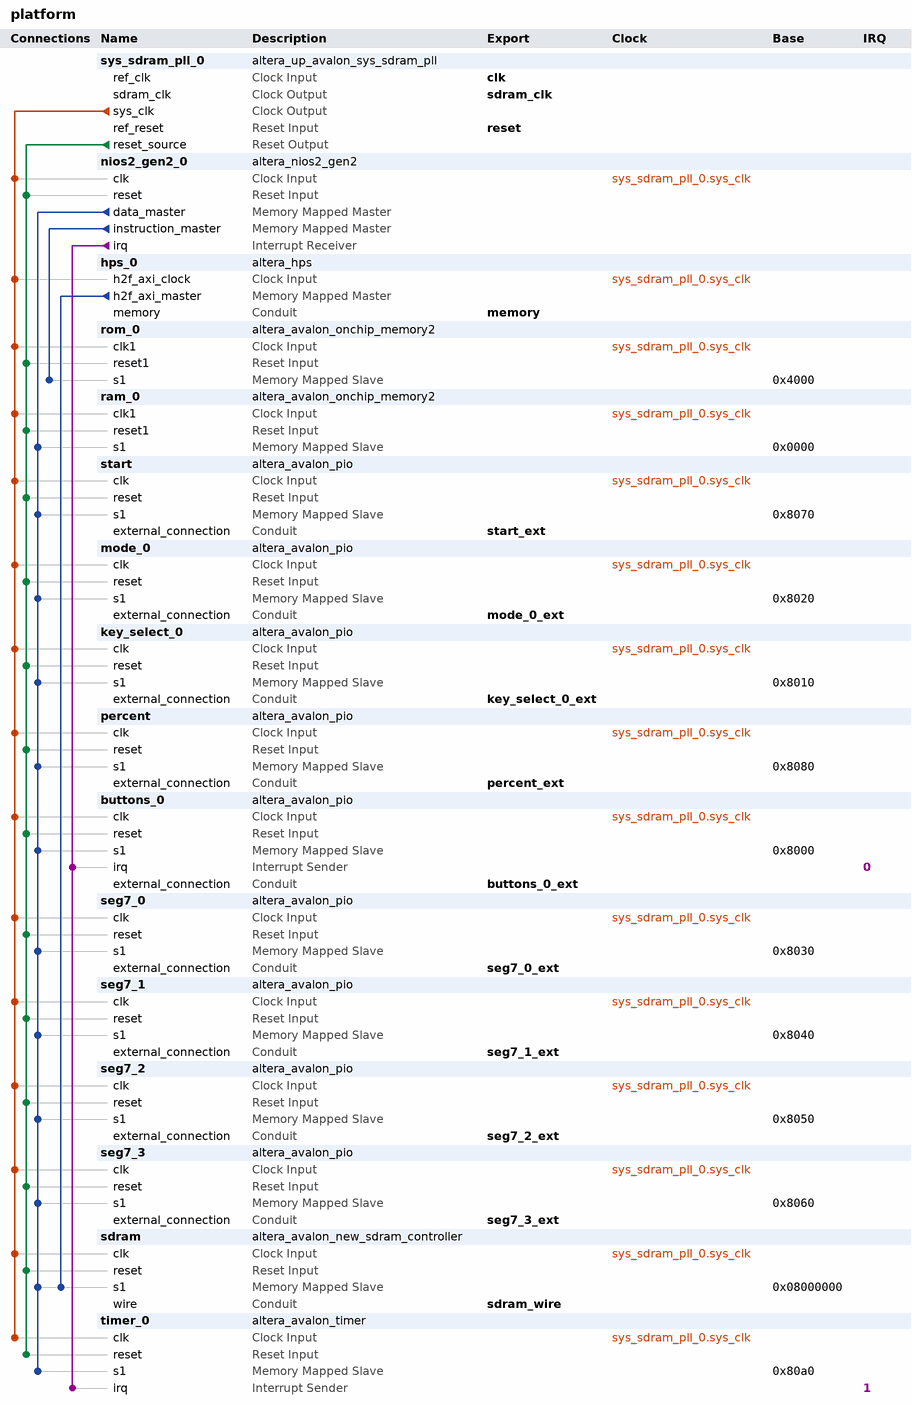
[diagram p0: system contents]
# Platform Designer (Qsys) system platform, Cyclone V 5CSEMA5F31C6
# Parameters at their usual value, and those the tool derives, are not listed.
package require -exact qsys 20.1
create_system platform
set_project_property DEVICE_FAMILY {Cyclone V}
set_project_property DEVICE 5CSEMA5F31C6

add_instance sys_sdram_pll_0 altera_up_avalon_sys_sdram_pll 18.0
set_instance_parameter_value sys_sdram_pll_0 CV_boards DE1-SoC
set_instance_parameter_value sys_sdram_pll_0 gui_outclk 50.0
set_instance_parameter_value sys_sdram_pll_0 gui_refclk 50.0

add_instance nios2_gen2_0 altera_nios2_gen2 20.1
set_instance_parameter_value nios2_gen2_0 dcache_size 2048
set_instance_parameter_value nios2_gen2_0 debug_enabled false
set_instance_parameter_value nios2_gen2_0 exceptionSlave rom_0.s1
set_instance_parameter_value nios2_gen2_0 icache_size 4096
set_instance_parameter_value nios2_gen2_0 impl Tiny
set_instance_parameter_value nios2_gen2_0 resetSlave rom_0.s1

add_instance hps_0 altera_hps 20.1
set_instance_parameter_value hps_0 EMAC1_Mode N/A
set_instance_parameter_value hps_0 EMAC1_PinMuxing Unused
set_instance_parameter_value hps_0 F2SCLK_COLDRST_Enable false
set_instance_parameter_value hps_0 F2SCLK_DBGRST_Enable false
set_instance_parameter_value hps_0 F2SCLK_WARMRST_Enable false
set_instance_parameter_value hps_0 F2SINTERRUPT_Enable false
set_instance_parameter_value hps_0 F2S_Width 0
set_instance_parameter_value hps_0 FPGA_PERIPHERAL_OUTPUT_CLOCK_FREQ_EMAC0_GTX_CLK 125
set_instance_parameter_value hps_0 FPGA_PERIPHERAL_OUTPUT_CLOCK_FREQ_EMAC0_MD_CLK 2.5
set_instance_parameter_value hps_0 FPGA_PERIPHERAL_OUTPUT_CLOCK_FREQ_EMAC1_GTX_CLK 125
set_instance_parameter_value hps_0 FPGA_PERIPHERAL_OUTPUT_CLOCK_FREQ_EMAC1_MD_CLK 2.5
set_instance_parameter_value hps_0 HPS_PROTOCOL DDR3
set_instance_parameter_value hps_0 I2C0_Mode N/A
set_instance_parameter_value hps_0 I2C0_PinMuxing Unused
set_instance_parameter_value hps_0 I2C1_Mode N/A
set_instance_parameter_value hps_0 I2C1_PinMuxing Unused
set_instance_parameter_value hps_0 LWH2F_Enable false
set_instance_parameter_value hps_0 MEM_BANKADDR_WIDTH 3
set_instance_parameter_value hps_0 MEM_CLK_FREQ 300.0
set_instance_parameter_value hps_0 MEM_CLK_FREQ_MAX 400.0
set_instance_parameter_value hps_0 MEM_COL_ADDR_WIDTH 8
set_instance_parameter_value hps_0 MEM_DQ_WIDTH 8
set_instance_parameter_value hps_0 MEM_DRV_STR RZQ/6
set_instance_parameter_value hps_0 MEM_ROW_ADDR_WIDTH 12
set_instance_parameter_value hps_0 MEM_RTT_NOM {ODT Disabled}
set_instance_parameter_value hps_0 MEM_RTT_WR {Dynamic ODT off}
set_instance_parameter_value hps_0 MEM_TCL 7
set_instance_parameter_value hps_0 MEM_TFAW_NS 37.5
set_instance_parameter_value hps_0 MEM_TINIT_US 499
set_instance_parameter_value hps_0 MEM_TMRD_CK 3
set_instance_parameter_value hps_0 MEM_TRAS_NS 40.0
set_instance_parameter_value hps_0 MEM_TRCD_NS 15.0
set_instance_parameter_value hps_0 MEM_TREFI_US 7.0
set_instance_parameter_value hps_0 MEM_TRFC_NS 75.0
set_instance_parameter_value hps_0 MEM_TRP_NS 15.0
set_instance_parameter_value hps_0 MEM_TWTR 2
set_instance_parameter_value hps_0 MEM_VENDOR JEDEC
set_instance_parameter_value hps_0 MEM_WTCL 6
set_instance_parameter_value hps_0 QSPI_Mode N/A
set_instance_parameter_value hps_0 QSPI_PinMuxing Unused
set_instance_parameter_value hps_0 REF_CLK_FREQ 125.0
set_instance_parameter_value hps_0 S2FCLK_USER2CLK 5
set_instance_parameter_value hps_0 S2F_Width 1
set_instance_parameter_value hps_0 SDIO_Mode N/A
set_instance_parameter_value hps_0 SDIO_PinMuxing Unused
set_instance_parameter_value hps_0 SPIM1_Mode N/A
set_instance_parameter_value hps_0 SPIM1_PinMuxing Unused
set_instance_parameter_value hps_0 STM_Enable false
set_instance_parameter_value hps_0 TIMING_BOARD_AC_SKEW 0.02
set_instance_parameter_value hps_0 TIMING_BOARD_AC_TO_CK_SKEW 0.0
set_instance_parameter_value hps_0 TIMING_BOARD_DQ_TO_DQS_SKEW 0.0
set_instance_parameter_value hps_0 TIMING_BOARD_MAX_CK_DELAY 0.6
set_instance_parameter_value hps_0 TIMING_BOARD_MAX_DQS_DELAY 0.6
set_instance_parameter_value hps_0 TIMING_BOARD_SKEW_BETWEEN_DQS 0.02
set_instance_parameter_value hps_0 TIMING_BOARD_SKEW_CKDQS_DIMM_MAX 0.01
set_instance_parameter_value hps_0 TIMING_BOARD_SKEW_CKDQS_DIMM_MIN -0.01
set_instance_parameter_value hps_0 TIMING_BOARD_SKEW_WITHIN_DQS 0.02
set_instance_parameter_value hps_0 TIMING_TDH 125
set_instance_parameter_value hps_0 TIMING_TDQSCK 400
set_instance_parameter_value hps_0 TIMING_TDQSQ 120
set_instance_parameter_value hps_0 TIMING_TDS 50
set_instance_parameter_value hps_0 TIMING_TIH 250
set_instance_parameter_value hps_0 TIMING_TIS 175
set_instance_parameter_value hps_0 TIMING_TQSH 0.38
set_instance_parameter_value hps_0 UART0_Mode N/A
set_instance_parameter_value hps_0 UART0_PinMuxing Unused
set_instance_parameter_value hps_0 USB1_Mode N/A
set_instance_parameter_value hps_0 USB1_PinMuxing Unused
set_instance_parameter_value hps_0 desired_cfg_clk_mhz 50.0
set_instance_parameter_value hps_0 desired_qspi_clk_mhz 400.0

add_instance rom_0 altera_avalon_onchip_memory2 20.1
set_instance_parameter_value rom_0 dataWidth 32
set_instance_parameter_value rom_0 dualPort false
set_instance_parameter_value rom_0 initMemContent true
set_instance_parameter_value rom_0 initializationFileName onchip_mem.hex
set_instance_parameter_value rom_0 memorySize 16384
set_instance_parameter_value rom_0 writable false

add_instance ram_0 altera_avalon_onchip_memory2 20.1
set_instance_parameter_value ram_0 dataWidth 32
set_instance_parameter_value ram_0 dualPort false
set_instance_parameter_value ram_0 initMemContent true
set_instance_parameter_value ram_0 initializationFileName onchip_mem.hex
set_instance_parameter_value ram_0 memorySize 8192

add_instance start altera_avalon_pio 20.1
set_instance_parameter_value start direction Input
set_instance_parameter_value start width 1

add_instance mode_0 altera_avalon_pio 20.1
set_instance_parameter_value mode_0 direction Input
set_instance_parameter_value mode_0 width 1

add_instance key_select_0 altera_avalon_pio 20.1
set_instance_parameter_value key_select_0 direction Input
set_instance_parameter_value key_select_0 width 1

add_instance percent altera_avalon_pio 20.1
set_instance_parameter_value percent direction Input
set_instance_parameter_value percent width 1

add_instance buttons_0 altera_avalon_pio 20.1
set_instance_parameter_value buttons_0 captureEdge true
set_instance_parameter_value buttons_0 direction Input
set_instance_parameter_value buttons_0 generateIRQ true
set_instance_parameter_value buttons_0 irqType EDGE
set_instance_parameter_value buttons_0 width 4

add_instance seg7_0 altera_avalon_pio 20.1
set_instance_parameter_value seg7_0 direction Output
set_instance_parameter_value seg7_0 width 7

add_instance seg7_1 altera_avalon_pio 20.1
set_instance_parameter_value seg7_1 direction Output
set_instance_parameter_value seg7_1 width 7

add_instance seg7_2 altera_avalon_pio 20.1
set_instance_parameter_value seg7_2 direction Output
set_instance_parameter_value seg7_2 width 7

add_instance seg7_3 altera_avalon_pio 20.1
set_instance_parameter_value seg7_3 direction Output
set_instance_parameter_value seg7_3 width 7

add_instance sdram altera_avalon_new_sdram_controller 20.1
set_instance_parameter_value sdram TAC 5.4
set_instance_parameter_value sdram TRCD 15.0
set_instance_parameter_value sdram TRP 15.0
set_instance_parameter_value sdram casLatency 3
set_instance_parameter_value sdram columnWidth 10
set_instance_parameter_value sdram dataWidth 16
set_instance_parameter_value sdram generateSimulationModel false
set_instance_parameter_value sdram model single_Micron_MT48LC4M32B2_7_chip
set_instance_parameter_value sdram numberOfBanks 4
set_instance_parameter_value sdram numberOfChipSelects 1
set_instance_parameter_value sdram powerUpDelay 100.0
set_instance_parameter_value sdram refreshPeriod 7.8125
set_instance_parameter_value sdram rowWidth 13

add_instance timer_0 altera_avalon_timer 20.1
set_instance_parameter_value timer_0 alwaysRun true
set_instance_parameter_value timer_0 fixedPeriod true
set_instance_parameter_value timer_0 period 1
set_instance_parameter_value timer_0 periodUnits SEC
set_instance_parameter_value timer_0 snapshot false

# connections
add_connection sys_sdram_pll_0.sys_clk buttons_0.clk clock
add_connection sys_sdram_pll_0.sys_clk hps_0.h2f_axi_clock clock
add_connection sys_sdram_pll_0.sys_clk key_select_0.clk clock
add_connection sys_sdram_pll_0.sys_clk mode_0.clk clock
add_connection sys_sdram_pll_0.sys_clk nios2_gen2_0.clk clock
add_connection sys_sdram_pll_0.sys_clk percent.clk clock
add_connection sys_sdram_pll_0.sys_clk ram_0.clk1 clock
add_connection sys_sdram_pll_0.sys_clk rom_0.clk1 clock
add_connection sys_sdram_pll_0.sys_clk sdram.clk clock
add_connection sys_sdram_pll_0.sys_clk seg7_0.clk clock
add_connection sys_sdram_pll_0.sys_clk seg7_1.clk clock
add_connection sys_sdram_pll_0.sys_clk seg7_2.clk clock
add_connection sys_sdram_pll_0.sys_clk seg7_3.clk clock
add_connection sys_sdram_pll_0.sys_clk start.clk clock
add_connection sys_sdram_pll_0.sys_clk timer_0.clk clock
add_connection sys_sdram_pll_0.reset_source buttons_0.reset reset
add_connection sys_sdram_pll_0.reset_source key_select_0.reset reset
add_connection sys_sdram_pll_0.reset_source mode_0.reset reset
add_connection sys_sdram_pll_0.reset_source nios2_gen2_0.reset reset
add_connection sys_sdram_pll_0.reset_source percent.reset reset
add_connection sys_sdram_pll_0.reset_source ram_0.reset1 reset
add_connection sys_sdram_pll_0.reset_source rom_0.reset1 reset
add_connection sys_sdram_pll_0.reset_source sdram.reset reset
add_connection sys_sdram_pll_0.reset_source seg7_0.reset reset
add_connection sys_sdram_pll_0.reset_source seg7_1.reset reset
add_connection sys_sdram_pll_0.reset_source seg7_2.reset reset
add_connection sys_sdram_pll_0.reset_source seg7_3.reset reset
add_connection sys_sdram_pll_0.reset_source start.reset reset
add_connection sys_sdram_pll_0.reset_source timer_0.reset reset
add_connection hps_0.h2f_axi_master sdram.s1 avalon
set_connection_parameter_value hps_0.h2f_axi_master/sdram.s1 baseAddress 0x08000000
add_connection nios2_gen2_0.data_master buttons_0.s1 avalon
set_connection_parameter_value nios2_gen2_0.data_master/buttons_0.s1 baseAddress 0x8000
add_connection nios2_gen2_0.data_master key_select_0.s1 avalon
set_connection_parameter_value nios2_gen2_0.data_master/key_select_0.s1 baseAddress 0x8010
add_connection nios2_gen2_0.data_master mode_0.s1 avalon
set_connection_parameter_value nios2_gen2_0.data_master/mode_0.s1 baseAddress 0x8020
add_connection nios2_gen2_0.data_master percent.s1 avalon
set_connection_parameter_value nios2_gen2_0.data_master/percent.s1 baseAddress 0x8080
add_connection nios2_gen2_0.data_master ram_0.s1 avalon
set_connection_parameter_value nios2_gen2_0.data_master/ram_0.s1 baseAddress 0x0000
add_connection nios2_gen2_0.data_master sdram.s1 avalon
set_connection_parameter_value nios2_gen2_0.data_master/sdram.s1 baseAddress 0x08000000
add_connection nios2_gen2_0.data_master seg7_0.s1 avalon
set_connection_parameter_value nios2_gen2_0.data_master/seg7_0.s1 baseAddress 0x8030
add_connection nios2_gen2_0.data_master seg7_1.s1 avalon
set_connection_parameter_value nios2_gen2_0.data_master/seg7_1.s1 baseAddress 0x8040
add_connection nios2_gen2_0.data_master seg7_2.s1 avalon
set_connection_parameter_value nios2_gen2_0.data_master/seg7_2.s1 baseAddress 0x8050
add_connection nios2_gen2_0.data_master seg7_3.s1 avalon
set_connection_parameter_value nios2_gen2_0.data_master/seg7_3.s1 baseAddress 0x8060
add_connection nios2_gen2_0.data_master start.s1 avalon
set_connection_parameter_value nios2_gen2_0.data_master/start.s1 baseAddress 0x8070
add_connection nios2_gen2_0.data_master timer_0.s1 avalon
set_connection_parameter_value nios2_gen2_0.data_master/timer_0.s1 baseAddress 0x80a0
add_connection nios2_gen2_0.instruction_master rom_0.s1 avalon
set_connection_parameter_value nios2_gen2_0.instruction_master/rom_0.s1 baseAddress 0x4000
add_connection nios2_gen2_0.irq buttons_0.irq interrupt
set_connection_parameter_value nios2_gen2_0.irq/buttons_0.irq irqNumber 0
add_connection nios2_gen2_0.irq timer_0.irq interrupt
set_connection_parameter_value nios2_gen2_0.irq/timer_0.irq irqNumber 1

# exported interfaces
add_interface buttons_0_ext conduit end
set_interface_property buttons_0_ext EXPORT_OF buttons_0.external_connection
add_interface clk clock sink
set_interface_property clk EXPORT_OF sys_sdram_pll_0.ref_clk
add_interface key_select_0_ext conduit end
set_interface_property key_select_0_ext EXPORT_OF key_select_0.external_connection
add_interface memory conduit end
set_interface_property memory EXPORT_OF hps_0.memory
add_interface mode_0_ext conduit end
set_interface_property mode_0_ext EXPORT_OF mode_0.external_connection
add_interface percent_ext conduit end
set_interface_property percent_ext EXPORT_OF percent.external_connection
add_interface reset reset sink
set_interface_property reset EXPORT_OF sys_sdram_pll_0.ref_reset
add_interface sdram_clk clock source
set_interface_property sdram_clk EXPORT_OF sys_sdram_pll_0.sdram_clk
add_interface sdram_wire conduit end
set_interface_property sdram_wire EXPORT_OF sdram.wire
add_interface seg7_0_ext conduit end
set_interface_property seg7_0_ext EXPORT_OF seg7_0.external_connection
add_interface seg7_1_ext conduit end
set_interface_property seg7_1_ext EXPORT_OF seg7_1.external_connection
add_interface seg7_2_ext conduit end
set_interface_property seg7_2_ext EXPORT_OF seg7_2.external_connection
add_interface seg7_3_ext conduit end
set_interface_property seg7_3_ext EXPORT_OF seg7_3.external_connection
add_interface start_ext conduit end
set_interface_property start_ext EXPORT_OF start.external_connection

set_interconnect_requirement {$system} qsys_mm.clockCrossingAdapter HANDSHAKE
set_interconnect_requirement {$system} qsys_mm.enableEccProtection FALSE
set_interconnect_requirement {$system} qsys_mm.insertDefaultSlave FALSE
set_interconnect_requirement {$system} qsys_mm.maxAdditionalLatency 1

save_system platform.qsys
